# Altium schematic sheet STM32_BOARD_v1a_powerSupply.SchDoc: Power Supply  & Mechanics
size A4; Author: Aljaž Murovec; DrawnBy: Aljaž Murovec; Revision: A; SheetNumber: 2; SheetTotal: 2
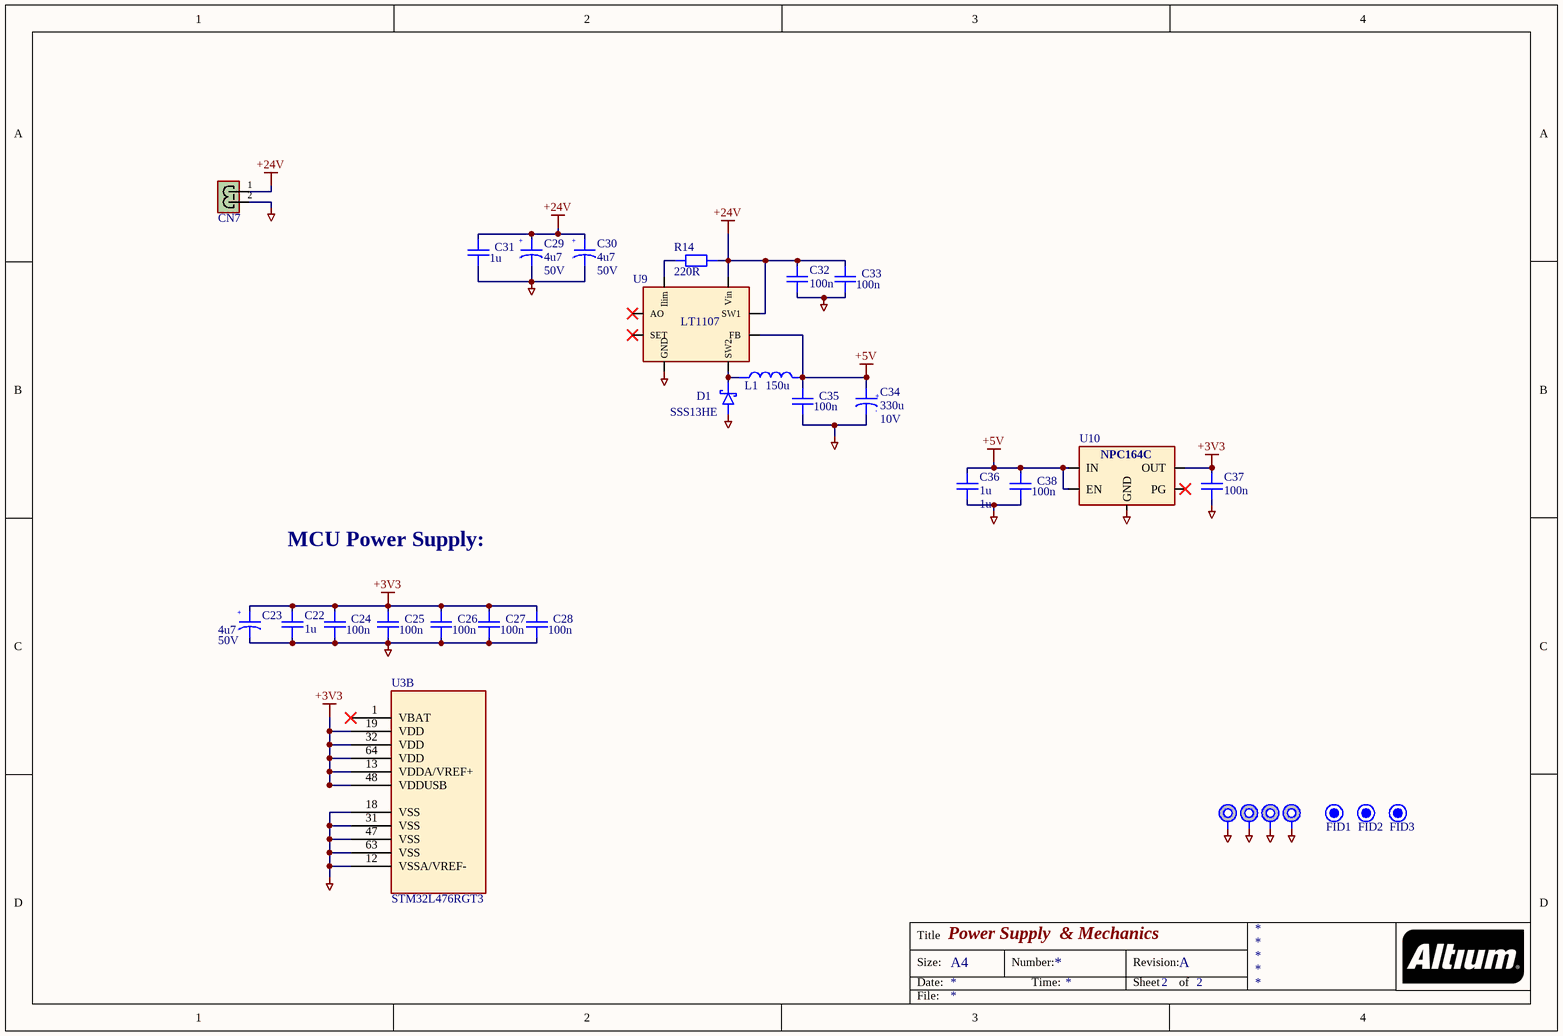
[diagram p0: STM32_BOARD_v1a_powerSupply.SchDoc]

## Parts
C22  1u  [CAP_SMD]
C23  Voltage: 50V  [865230642008]  (hidden comment: 4u7)
C24  100n  [CAP_SMD]
C25  100n  [CAP_SMD]
C26  100n  [CAP_SMD]
C27  100n  [CAP_SMD]
C28  100n  [CAP_SMD]
C29  Voltage: 50V  [865230642008]  (hidden comment: 4u7)
C30  Voltage: 50V  [865230642008]  (hidden comment: 4u7)
C31  1u  [CAP_SMD]
C32  100n  [CAP_SMD]
C33  100n  [CAP_SMD]
C34  Voltage: 10V  [CAPAE10083X105M]  (hidden comment: 330u)
C35  100n  [CAP_SMD]
C36  1u  [CAP_SMD]
C37  100n  [CAP_SMD]
C38  100n  [CAP_SMD]
CN7  PHOENIX_CONTACT_2x1_  [1755516]  (value not drawn)
D1  SSS13HE  [SOD-323HE]
FID1  FID-2mm  [fid-2mm]  (value not drawn)  (graphical)
FID2  FID-2mm  [fid-2mm]  (value not drawn)  (graphical)
FID3  FID-2mm  [fid-2mm]  (value not drawn)  (graphical)
L1  150u  [744770215]
MH1  Mounting hole, non-plated, 2.2mm  [MH-2mm2]  (value not drawn)  (no BOM)
MH2  Mounting hole, non-plated, 2.2mm  [MH-2mm2]  (value not drawn)  (no BOM)
MH3  Mounting hole, non-plated, 2.2mm  [MH-2mm2]  (value not drawn)  (no BOM)
MH4  Mounting hole, non-plated, 2.2mm  [MH-2mm2]  (value not drawn)  (no BOM)
R14  220R  [RES_0805]
U3  32-bit Microcontroller  [LQFP64_10x10mm]  (value not drawn)  (part B of 2)
U9  LT1107  [SOIC127P600X175-8N]
U10  NCP164C  [NCP164C_TSOP-5]  (value not drawn)

## Nets
+3V3: C22.2(Pin_2) C23.1(Pin_1) C24.2(Pin_2) C25.2(Pin_2) C26.2(Pin_2) C27.2(Pin_2) C28.2(Pin_2) C37.2(Pin_2) U3.13(VDDA/VREF+) U3.19(VDD) U3.32(VDD) U3.48(VDDUSB) U3.64(VDD) U10.5(OUT)
+5V: C34.1(Pin_1) C35.2(Pin_2) C36.2(Pin_2) C38.2(Pin_2) L1.2(Pin_2) U9.8(FB) U10.1(IN) U10.3(EN)
+24V: C29.1(Pin_1) C30.1(Pin_1) C31.2(Pin_2) C32.2(Pin_2) C33.2(Pin_2) CN7.1(Pin_1) R14.1(Pin_1) U9.2(Vin) U9.3(SW1)
GND: C22.1(Pin_1) C23.2(Pin_2) C24.1(Pin_1) C25.1(Pin_1) C26.1(Pin_1) C27.1(Pin_1) C28.1(Pin_1) C29.2(Pin_2) C30.2(Pin_2) C31.1(Pin_1) C32.1(Pin_1) C33.1(Pin_1) C34.2(Pin_2) C35.1(Pin_1) C36.1(Pin_1) C37.1(Pin_1) C38.1(Pin_1) CN7.2(Pin_2) D1.2(A) MH1.1(Pin1) MH2.1(Pin1) MH3.1(Pin1) MH4.1(Pin1) U3.12(VSSA/VREF-) U3.18(VSS) U3.31(VSS) U3.47(VSS) U3.63(VSS) U9.5(GND) U10.2(GND)
NetD1_1: D1.1(C) L1.1(Pin_1) U9.4(SW2)
NetR14_2: R14.2(Pin_2) U9.1(Ilim)

Not connected (* = marked no-connect by the designer): U3 1(VBAT)*; U9 6(AO)* 7(SET)*; U10 4(PG)*

## Notes on the sheet
- MCU Power Supply:
- Title
- Size:
- Date:
- A4
- Number:
- Time:
- Revision:
- Sheet
- of
- File:
- (in symbol CAP_POLAR_4u7_50V) +; -
- (in symbol CAP_POLAR_330u_50V) +; -
- (in symbol NCP164C) NPC164C

## Library data of the parts
C22 C24-C28 C31-C33 C35-C38 = C: Voltage Rating: *; Temperature Range: -55~125°C; Tolerance: *
  C22 C31 C36: Capacitance: 1u
  C24-C28 C32 C33 C35 C37 C38: Capacitance: 100n
C23 C29 C30 = CAP_POLAR_4u7_50V: SMD Aluminium Electrolytic Capacitor, Radial Can - SMD, 4.7 µF, 50 V, 5000 hours @ 105°C, Polar; Manufacturer: Wurth Elektrinik; Mfr Part Num: 865230642008; Value: 4u7
C34 = CAP_POLAR_330u_50V: SMD Aluminium Electrolytic Capacitor, Radial Can - SMD, 4.7 µF, 50 V, 5000 hours @ 105°C, Polar; Manufacturer: Kemet; Mfr Part Num: EDK337M010A9MAA; Value: 330u
CN7 = PHOENIX_CONTACT_2x1_: Pin header, straight, Straight, 5mm Pitch, 2 Poles, Phoenix Contact; Manufacturer: Phoenix Contact; Mfr Part Num.: 1755516
D1 = SS13HE: Surface Mount Schottky Barrier Rectifier.; Manufacturer: ON Semiconductor; Forward Voltage Max.: 550mV; Forward Current: 1A; Forward Surge Current Max: 25A; Mfr Part Num.: SSS13HE; Operating temperature: 150°C
L1 = L_105uH_744770215: Power Inductor (SMD), 150 µH, 1.8 A, Shielded, 1.8 A, WE-PD, 12mm x 12mm x 8mm; Manufacturer: Wurth Elektronik; RMS Current: 1.8A; DC Resistance Max: 0.28R; Mfr Part Num.: 744770215; Inductance: 150u
MH1-MH4 = MH-2mm2
R14 = R: Tolerance: *; Resistance: 220R
U3 = STM32L476RGT3: STM32 Arm-based 32-bit Microcontroller; Manufacturer: STMicroelectronics; Supply Voltage: 1.7V~3.6V; RAM Memory Size: 128kB; CPU Speed: 80MHz; Program Memory Size: 1MB; Temperature range: -40~125°C; Mfr Part Num: STM32L476RGT3
U9 = LT1107: Micropower / DC/DC Converter / Adjustable and Fixed 5V, 12V; Manufacturer: Linear technology; Mfr Part Num.: LT1107
U10 = NCP164C: LDO Regulator, 300mA, / Low Dropout Voltage, Ultra Low Noise, High PSRR with Power Good; Manufacturer: On Semiconductor; Mfr Part Num.: NCP164CSN330T1G; Input Voltage: 1.6V~5V; Current: 300mA; Output Voltage: 3.3V